# Altium schematic sheet monitoring.SchDoc
size Tabloid
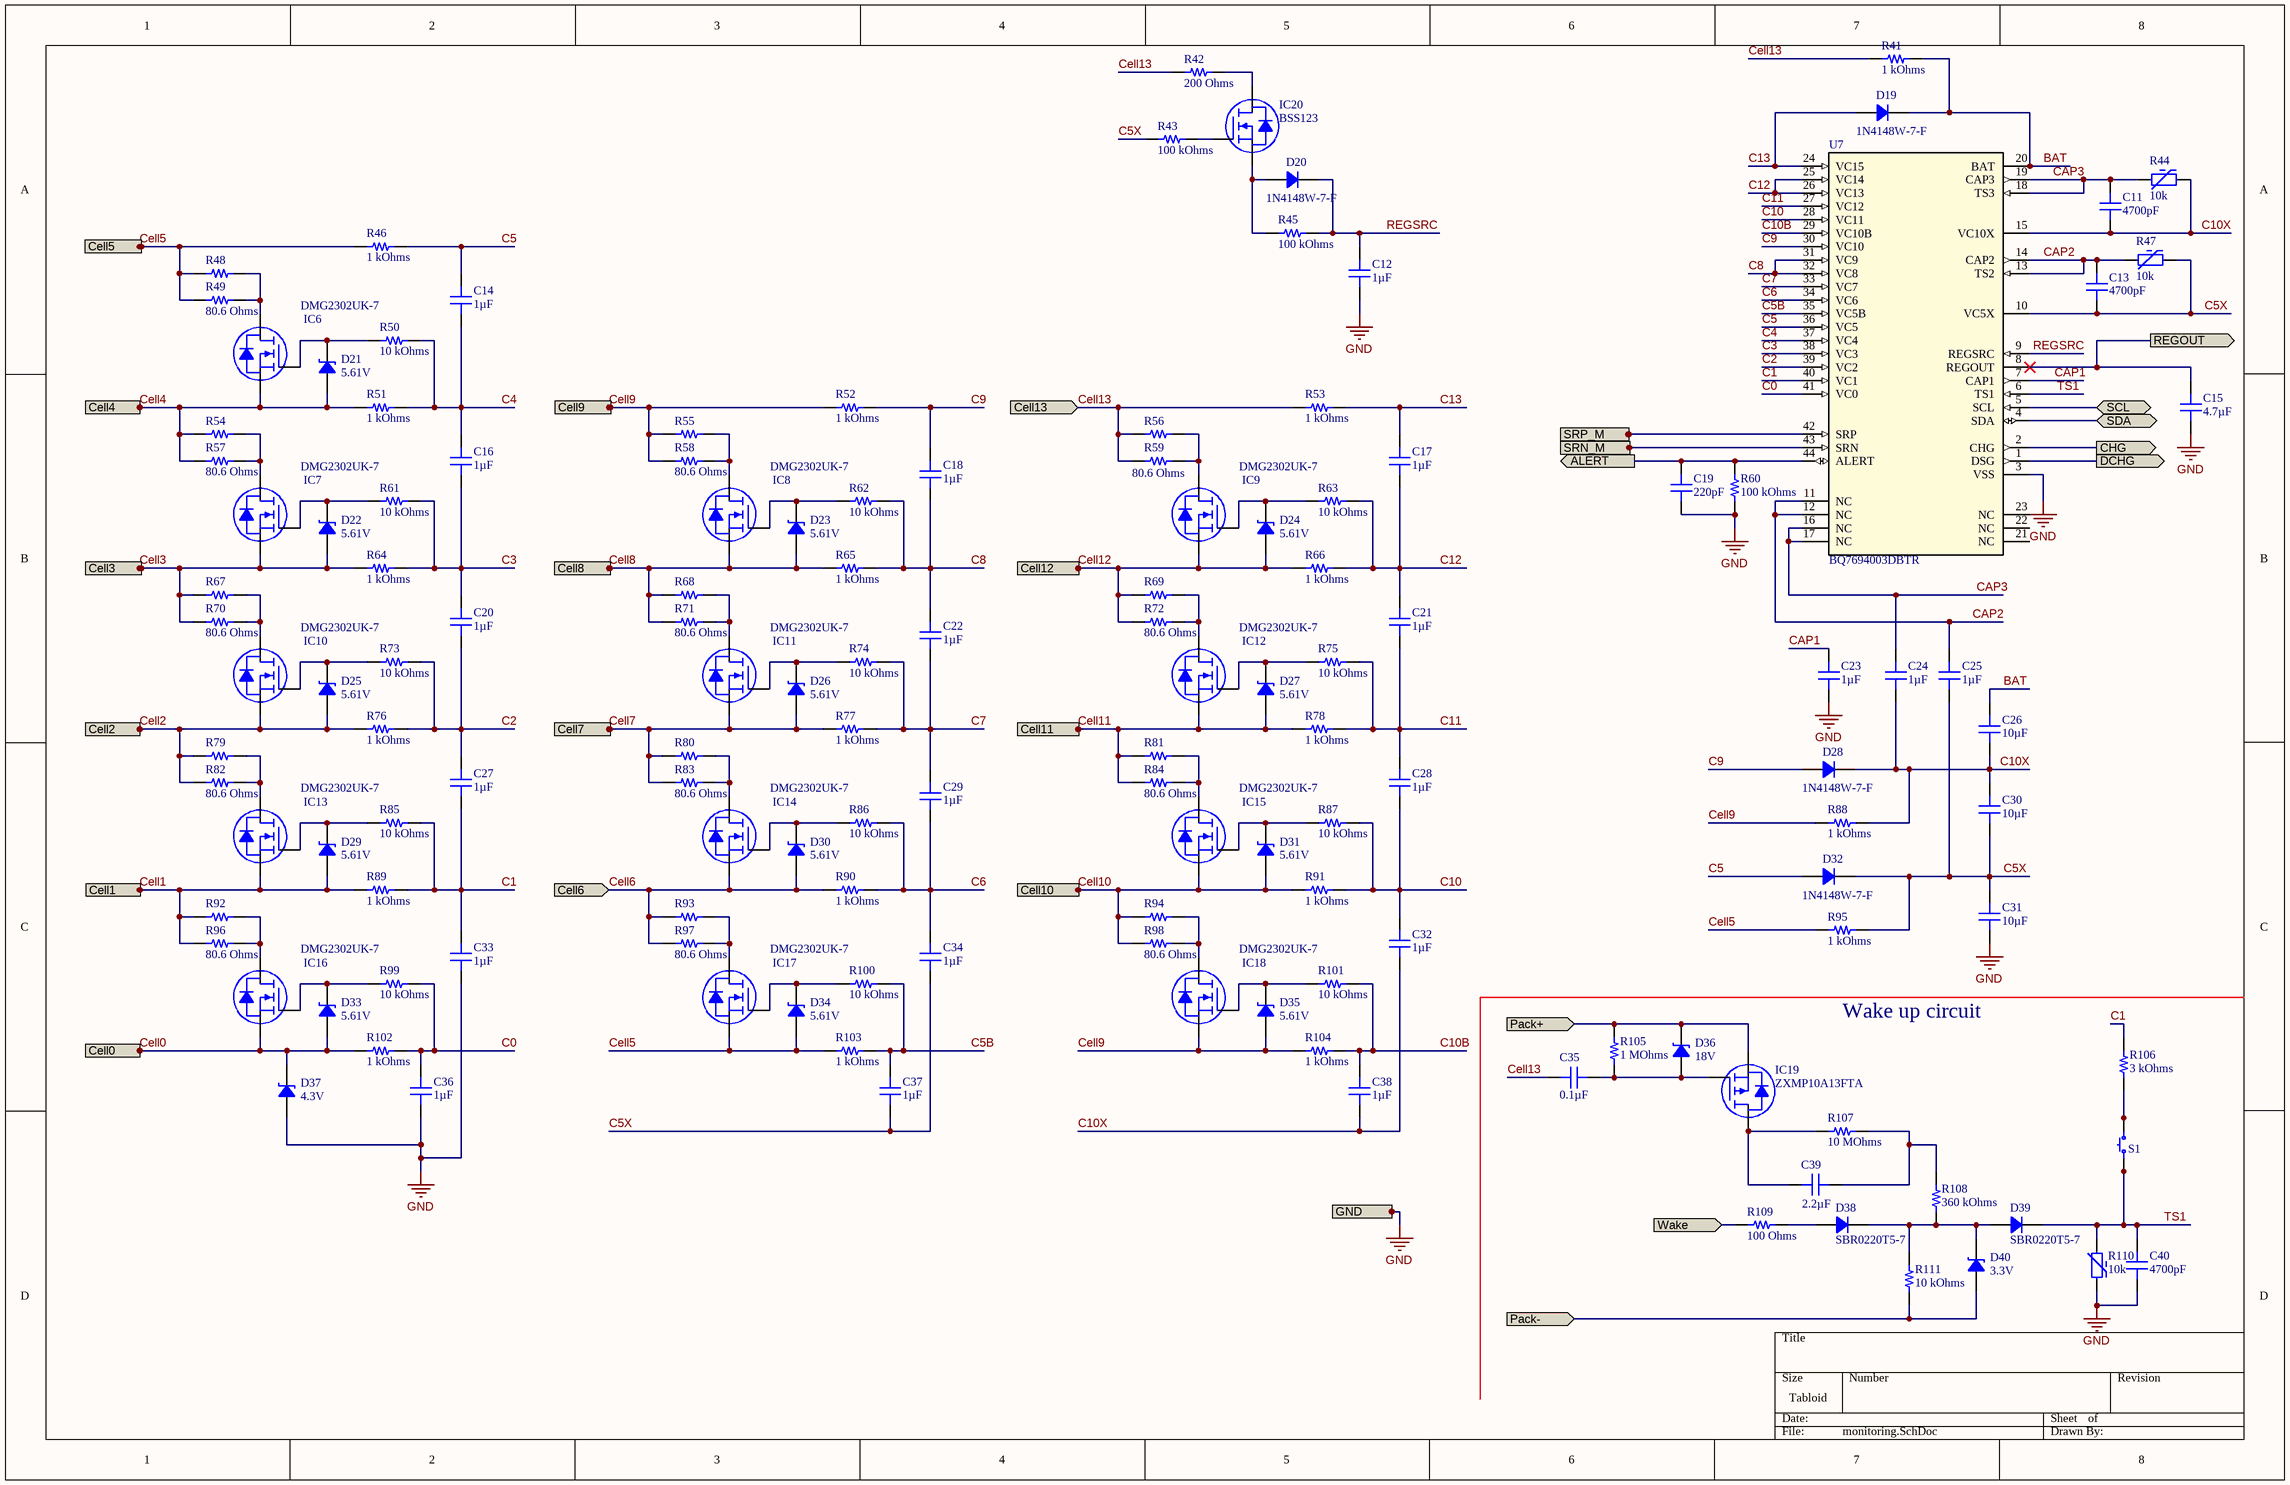
[diagram p0: monitoring.SchDoc]

## Parts
C11  4700pF  [CAP 0805_2012]
C12  1µF  [CAP 0603_1608]
C13  4700pF  [CAP 0805_2012]
C14  1µF  [CAP 0603_1608]
C15  4.7µF  [CAP 0805_2012]
C16  1µF  [CAP 0603_1608]
C17  1µF  [CAP 0603_1608]
C18  1µF  [CAP 0603_1608]
C19  220pF  [CAP 0603_1608]
C20  1µF  [CAP 0603_1608]
C21  1µF  [CAP 0603_1608]
C22  1µF  [CAP 0603_1608]
C23  1µF  [CAP 0603_1608]
C24  1µF  [CAP 0603_1608]
C25  1µF  [CAP 0603_1608]
C26  10µF  [CAP 1210_3225 - 2.8MM]
C27  1µF  [CAP 0603_1608]
C28  1µF  [CAP 0603_1608]
C29  1µF  [CAP 0603_1608]
C30  10µF  [CAP 1210_3225 - 2.8MM]
C31  10µF  [CAP 1210_3225 - 2.8MM]
C32  1µF  [CAP 0603_1608]
C33  1µF  [CAP 0603_1608]
C34  1µF  [CAP 0603_1608]
C35  0.1µF  [CAP 0603_1608]
C36  1µF  [CAP 0603_1608]
C37  1µF  [CAP 0603_1608]
C38  1µF  [CAP 0603_1608]
C39  2.2µF  [CAP 1210_3225 - 2.5MM]
C40  4700pF  [CAP 0805_2012]
D19  1N4148W-7-F  [SOD-123]
D20  1N4148W-7-F  [SOD-123]
D21  Voltage - Zener (Nom) (Vz): 5.61V  [SOD523F]  (hidden comment: MM5Z5V6ST1G)
D22  Voltage - Zener (Nom) (Vz): 5.61V  [SOD523F]  (hidden comment: MM5Z5V6ST1G)
D23  Voltage - Zener (Nom) (Vz): 5.61V  [SOD523F]  (hidden comment: MM5Z5V6ST1G)
D24  Voltage - Zener (Nom) (Vz): 5.61V  [SOD523F]  (hidden comment: MM5Z5V6ST1G)
D25  Voltage - Zener (Nom) (Vz): 5.61V  [SOD523F]  (hidden comment: MM5Z5V6ST1G)
D26  Voltage - Zener (Nom) (Vz): 5.61V  [SOD523F]  (hidden comment: MM5Z5V6ST1G)
D27  Voltage - Zener (Nom) (Vz): 5.61V  [SOD523F]  (hidden comment: MM5Z5V6ST1G)
D28  1N4148W-7-F  [SOD-123]
D29  Voltage - Zener (Nom) (Vz): 5.61V  [SOD523F]  (hidden comment: MM5Z5V6ST1G)
D30  Voltage - Zener (Nom) (Vz): 5.61V  [SOD523F]  (hidden comment: MM5Z5V6ST1G)
D31  Voltage - Zener (Nom) (Vz): 5.61V  [SOD523F]  (hidden comment: MM5Z5V6ST1G)
D32  1N4148W-7-F  [SOD-123]
D33  Voltage - Zener (Nom) (Vz): 5.61V  [SOD523F]  (hidden comment: MM5Z5V6ST1G)
D34  Voltage - Zener (Nom) (Vz): 5.61V  [SOD523F]  (hidden comment: MM5Z5V6ST1G)
D35  Voltage - Zener (Nom) (Vz): 5.61V  [SOD523F]  (hidden comment: MM5Z5V6ST1G)
D36  Voltage - Zener (Nom) (Vz): 18V  [DIODES SOT-523]  (hidden comment: MMBZ5248BT-7-F)
D37  Voltage - Zener (Nom) (Vz): 4.3V  [SOD-123]  (hidden comment: MMSZ5229BT1G)
D38  SBR0220T5-7  [SOD-523]
D39  SBR0220T5-7  [SOD-523]
D40  Voltage - Zener (Nom) (Vz): 3.3V  [DIODES SOT-323-3]  (hidden comment: MMBZ5226BW-7-F)
IC6  DMG2302UK-7  [DIODES SOT-23-3]
IC7  DMG2302UK-7  [DIODES SOT-23-3]
IC8  DMG2302UK-7  [DIODES SOT-23-3]
IC9  DMG2302UK-7  [DIODES SOT-23-3]
IC10  DMG2302UK-7  [DIODES SOT-23-3]
IC11  DMG2302UK-7  [DIODES SOT-23-3]
IC12  DMG2302UK-7  [DIODES SOT-23-3]
IC13  DMG2302UK-7  [DIODES SOT-23-3]
IC14  DMG2302UK-7  [DIODES SOT-23-3]
IC15  DMG2302UK-7  [DIODES SOT-23-3]
IC16  DMG2302UK-7  [DIODES SOT-23-3]
IC17  DMG2302UK-7  [DIODES SOT-23-3]
IC18  DMG2302UK-7  [DIODES SOT-23-3]
IC19  ZXMP10A13FTA  [DIODES SOT-23-3]
IC20  BSS123  [ON SEMI SOT-23-3]
R41  1 kOhms  [RES 0603_1608]
R42  200 Ohms  [RES 0603_1608]
R43  100 kOhms  [RES 0603_1608]
R44  10k  [NTC 0603_1608]
R45  100 kOhms  [RES 0603_1608]
R46  1 kOhms  [RES 0603_1608]
R47  10k  [NTC 0603_1608]
R48  80.6 Ohms  [RES 1206_3216]  (value not drawn)
R49  80.6 Ohms  [RES 1206_3216]
R50  10 kOhms  [RES 0603_1608]
R51  1 kOhms  [RES 0603_1608]
R52  1 kOhms  [RES 0603_1608]
R53  1 kOhms  [RES 0603_1608]
R54  80.6 Ohms  [RES 1206_3216]  (value not drawn)
R55  80.6 Ohms  [RES 1206_3216]  (value not drawn)
R56  80.6 Ohms  [RES 1206_3216]  (value not drawn)
R57  80.6 Ohms  [RES 1206_3216]
R58  80.6 Ohms  [RES 1206_3216]
R59  80.6 Ohms  [RES 1206_3216]
R60  100 kOhms  [RES 0603_1608]
R61  10 kOhms  [RES 0603_1608]
R62  10 kOhms  [RES 0603_1608]
R63  10 kOhms  [RES 0603_1608]
R64  1 kOhms  [RES 0603_1608]
R65  1 kOhms  [RES 0603_1608]
R66  1 kOhms  [RES 0603_1608]
R67  80.6 Ohms  [RES 1206_3216]  (value not drawn)
R68  80.6 Ohms  [RES 1206_3216]  (value not drawn)
R69  80.6 Ohms  [RES 1206_3216]  (value not drawn)
R70  80.6 Ohms  [RES 1206_3216]
R71  80.6 Ohms  [RES 1206_3216]
R72  80.6 Ohms  [RES 1206_3216]
R73  10 kOhms  [RES 0603_1608]
R74  10 kOhms  [RES 0603_1608]
R75  10 kOhms  [RES 0603_1608]
R76  1 kOhms  [RES 0603_1608]
R77  1 kOhms  [RES 0603_1608]
R78  1 kOhms  [RES 0603_1608]
R79  80.6 Ohms  [RES 1206_3216]  (value not drawn)
R80  80.6 Ohms  [RES 1206_3216]  (value not drawn)
R81  80.6 Ohms  [RES 1206_3216]  (value not drawn)
R82  80.6 Ohms  [RES 1206_3216]
R83  80.6 Ohms  [RES 1206_3216]
R84  80.6 Ohms  [RES 1206_3216]
R85  10 kOhms  [RES 0603_1608]
R86  10 kOhms  [RES 0603_1608]
R87  10 kOhms  [RES 0603_1608]
R88  1 kOhms  [RES 0603_1608]
R89  1 kOhms  [RES 0603_1608]
R90  1 kOhms  [RES 0603_1608]
R91  1 kOhms  [RES 0603_1608]
R92  80.6 Ohms  [RES 1206_3216]  (value not drawn)
R93  80.6 Ohms  [RES 1206_3216]  (value not drawn)
R94  80.6 Ohms  [RES 1206_3216]  (value not drawn)
R95  1 kOhms  [RES 0603_1608]
R96  80.6 Ohms  [RES 1206_3216]
R97  80.6 Ohms  [RES 1206_3216]
R98  80.6 Ohms  [RES 1206_3216]
R99  10 kOhms  [RES 0603_1608]
R100  10 kOhms  [RES 0603_1608]
R101  10 kOhms  [RES 0603_1608]
R102  1 kOhms  [RES 0603_1608]
R103  1 kOhms  [RES 0603_1608]
R104  1 kOhms  [RES 0603_1608]
R105  1 MOhms  [RES 0603_1608]
R106  3 kOhms  [RES 0603_1608]
R107  10 MOhms  [RES 0603_1608]
R108  360 kOhms  [RES 0603_1608]
R109  100 Ohms  [RES 0603_1608]
R110  10k  [NTC 0603_1608]
R111  10 kOhms  [RES 0603_1608]
S1  PTS645SM43SMTR92 LFS  [C&K PTS645]  (value not drawn)
U7  BQ7694003DBTR  [TSSOP_44]

## Ports
ALERT (out), Cell0 (in), Cell1 (in), Cell2 (in), Cell3 (in), Cell4 (in), Cell5 (in), Cell6 (in), Cell7 (in), Cell8 (in), Cell9 (in), Cell10 (in), Cell11 (in), Cell12 (in), Cell13 (in), CHG (out), DCHG (out), GND, Pack+ (in), Pack- (in), REGOUT (out), SCL (bidir), SDA (bidir), SRN_M (in), SRP_M (in), Wake (in)

## Nets
GND: C12.1 C15.1 C19.1 C23.1 C31.1 C33.1 C36.1 C40.1 D37.1 R60.1 R110.1 U7.3(VSS) ; port GND
ALERT: C19.2 R60.2 U7.44(ALERT) ; port ALERT
BAT: C26.2 D19.2 R41.2 U7.20(BAT)
C0: C36.2 R99.1 R102.2 U7.41(VC0)
C1: C27.1 C33.2 R85.1 R89.2 R106.2 U7.40(VC1)
C2: C20.1 C27.2 R73.1 R76.2 U7.39(VC2)
C3: C16.1 C20.2 R61.1 R64.2 U7.38(VC3)
C4: C14.1 C16.2 R50.1 R51.2 U7.37(VC4)
C5: C14.2 D32.1 R46.2 U7.36(VC5)
C5B: C37.2 R100.1 R103.2 U7.35(VC5B)
C5X: C13.1 C25.1 C30.1 C31.2 C34.1 C37.1 D32.2 R43.2 R47.1 R95.2 U7.10(VC5X)
C6: C29.1 C34.2 R86.1 R90.2 U7.34(VC6)
C7: C22.1 C29.2 R74.1 R77.2 U7.33(VC7)
C8: C18.1 C22.2 R62.1 R65.2 U7.31(VC9) U7.32(VC8)
C9: C18.2 D28.1 R52.2 U7.30(VC10)
C10: C28.1 C32.2 R87.1 R91.2 U7.28(VC11)
C10B: C38.2 R101.1 R104.2 U7.29(VC10B)
C10X: C11.1 C24.1 C26.1 C30.2 C32.1 C38.1 D28.2 R44.1 R88.2 U7.15(VC10X)
C11: C21.1 C28.2 R75.1 R78.2 U7.27(VC12)
C12: C17.1 C21.2 R63.1 R66.2 U7.25(VC14) U7.26(VC13)
C13: C17.2 D19.1 R53.2 U7.24(VC15)
CAP1: C23.2 U7.7(CAP1)
CAP2: C13.2 C25.2 R47.2 U7.11(NC) U7.12(NC) U7.13(TS2) U7.14(CAP2)
CAP3: C11.2 C24.2 R44.2 U7.16(NC) U7.17(NC) U7.18(TS3) U7.19(CAP3)
Cell0: D33.1 D37.2 IC16.2(S) R102.1 ; port Cell0
Cell1: D29.1 IC13.2(S) R89.1 R92.1 R96.1 ; port Cell1
Cell2: D25.1 IC10.2(S) R76.1 R79.1 R82.1 ; port Cell2
Cell3: D22.1 IC7.2(S) R64.1 R67.1 R70.1 ; port Cell3
Cell4: D21.1 IC6.2(S) R51.1 R54.1 R57.1 ; port Cell4
Cell5: D34.1 IC17.2(S) R46.1 R48.1 R49.1 R95.1 R103.1 ; port Cell5
Cell6: D30.1 IC14.2(S) R90.1 R93.1 R97.1 ; port Cell6
Cell7: D26.1 IC11.2(S) R77.1 R80.1 R83.1 ; port Cell7
Cell8: D23.1 IC8.2(S) R65.1 R68.1 R71.1 ; port Cell8
Cell9: D35.1 IC18.2(S) R52.1 R55.1 R58.1 R88.1 R104.1 ; port Cell9
Cell10: D31.1 IC15.2(S) R91.1 R94.1 R98.1 ; port Cell10
Cell11: D27.1 IC12.2(S) R78.1 R81.1 R84.1 ; port Cell11
Cell12: D24.1 IC9.2(S) R66.1 R69.1 R72.1 ; port Cell12
Cell13: C35.2 R41.1 R42.1 R53.1 R56.1 R59.1 ; port Cell13
CHG: U7.2(CHG) ; port CHG
DCHG: U7.1(DSG) ; port DCHG
Pack+: D36.2 IC19.2(S) R105.1 ; port Pack+
Pack-: D40.1 R111.2 ; port Pack-
REGOUT: C15.2 U7.8(REGOUT) ; port REGOUT
REGSRC: C12.2 D20.2 R45.1 U7.9(REGSRC)
SCL: U7.5(SCL) ; port SCL
SDA: U7.4(SDA) ; port SDA
SRN_M: U7.43(SRN) ; port SRN_M
SRP_M: U7.42(SRP) ; port SRP_M
TS1: C40.2 D39.2 R110.2 S1.1 S1.2 U7.6(TS1)
Wake: R109.2 ; port Wake
NetC35_1: C35.1 D36.1 IC19.1(G) R105.2
NetC39_1: C39.1 IC19.3(D) R107.2
NetC39_2: C39.2 R107.1 R108.2
NetD20_1: D20.1 IC20.2(S) R45.2
NetD21_2: D21.2 IC6.1(G) R50.2
NetD22_2: D22.2 IC7.1(G) R61.2
NetD23_2: D23.2 IC8.1(G) R62.2
NetD24_2: D24.2 IC9.1(G) R63.2
NetD25_2: D25.2 IC10.1(G) R73.2
NetD26_2: D26.2 IC11.1(G) R74.2
NetD27_2: D27.2 IC12.1(G) R75.2
NetD29_2: D29.2 IC13.1(G) R85.2
NetD30_2: D30.2 IC14.1(G) R86.2
NetD31_2: D31.2 IC15.1(G) R87.2
NetD33_2: D33.2 IC16.1(G) R99.2
NetD34_2: D34.2 IC17.1(G) R100.2
NetD35_2: D35.2 IC18.1(G) R101.2
NetD38_1: D38.1 R109.1
NetD38_2: D38.2 D39.1 D40.2 R108.1 R111.1
NetIC6_3: IC6.3(D) R48.2 R49.2
NetIC7_3: IC7.3(D) R54.2 R57.2
NetIC8_3: IC8.3(D) R55.2 R58.2
NetIC9_3: IC9.3(D) R56.2 R59.2
NetIC10_3: IC10.3(D) R67.2 R70.2
NetIC11_3: IC11.3(D) R68.2 R71.2
NetIC12_3: IC12.3(D) R69.2 R72.2
NetIC13_3: IC13.3(D) R79.2 R82.2
NetIC14_3: IC14.3(D) R80.2 R83.2
NetIC15_3: IC15.3(D) R81.2 R84.2
NetIC16_3: IC16.3(D) R92.2 R96.2
NetIC17_3: IC17.3(D) R93.2 R97.2
NetIC18_3: IC18.3(D) R94.2 R98.2
NetIC20_1: IC20.1(G) R43.1
NetIC20_3: IC20.3(D) R42.2
NetR106_1: R106.1 S1.3 S1.4

Not connected (* = marked no-connect by the designer): U7 21(NC) 22(NC) 23(NC)

## Notes on the sheet
- Wake up circuit

## Library data of the parts
C11 C13 C40 = VJ0805Y472KXAAC: CAP CER 4700PF 50V X7R 0805; Manufacturer: Vishay Vitramon; Tolerance: ±10%; Part Number: VJ0805Y472KXAAC; Value: 4700pF; Applications: General Purpose; Capacitance: 4700pF; ComponentLink1Description: Datasheet; ComponentLink1URL: http://www.vishay.com/docs/45199/vjcommercialseries.pdf; ComponentLink2Description: DigiKey Link; ComponentLink2URL: http://digikey.com/product-detail/en/vishay-vitramon/VJ0805Y472KXAAC/720-1393-1-ND/3986147; Device Package: 0805 (2012 Metric); LastUpdated: 9/2/2020 1:04:35 AM; Lifecycle Status: Active; Minimum Order: 1; Mounting Type: Surface Mount, MLCC; Operating Temperature: -55°C ~ 125°C; Package / Case: 0805 (2012 Metric); Packaging: TapeAndReel; PartId: 6525; Part Status: Active; Price: 0.06; Series: VJ; Size / Dimension: 0.079" L x 0.049" W (2.00mm x 1.25mm); Supplier 1: DigiKey; Supplier Part Number 1: 720-1393-1-ND; Temperature Coefficient: X7R; Thickness (Max): 0.057" (1.45mm); Voltage - Rated: 50V
C12 C14 C16-C18 C20-C25 C27-C29 C32-C34 C36-C38 = CGA3E3X5R1H105K080AB: CAP CER 1UF 50V X5R 0603; Manufacturer: TDK Corporation; Tolerance: ±10%; Part Number: CGA3E3X5R1H105K080AB; Value: 1µF; Applications: Automotive; Capacitance: 1µF; ComponentLink1Description: Datasheet; ComponentLink1URL: https://product.tdk.com/info/en/catalog/datasheets/mlcc_automotive_general_en.pdf?ref_disty=digikey; ComponentLink2Description: DigiKey Link; ComponentLink2URL: http://digikey.com/product-detail/en/tdk-corporation/CGA3E3X5R1H105K080AB/445-7878-1-ND/2781382; Device Package: 0603 (1608 Metric); LastUpdated: 9/2/2020 1:03:17 AM; Lifecycle Status: Active; Minimum Order: 1; Mounting Type: Surface Mount, MLCC; Operating Temperature: -55°C ~ 85°C; Package / Case: 0603 (1608 Metric); Packaging: TapeAndReel; PartId: 12841; Part Status: Active; Price: 0.05; Ratings: AEC-Q200; Series: CGA; Size / Dimension: 0.063" L x 0.031" W (1.60mm x 0.80mm); Supplier 1: DigiKey; Supplier Part Number 1: 445-7878-1-ND; Temperature Coefficient: X5R; Thickness (Max): 0.035" (0.90mm); Voltage - Rated: 50V
C15 = CC0805KKX7R7BB475: CAP CER 4.7UF 16V X7R 0805; Manufacturer: Yageo; Tolerance: ±10%; Part Number: CC0805KKX7R7BB475; Value: 4.7µF; Applications: General Purpose; Capacitance: 4.7µF; ComponentLink1Description: Datasheet; ComponentLink1URL: https://www.yageo.com/upload/media/product/productsearch/datasheet/mlcc/UPY-GPHC_X7R_6.3V-to-50V_18.pdf; ComponentLink2Description: DigiKey Link; ComponentLink2URL: http://digikey.com/product-detail/en/yageo/CC0805KKX7R7BB475/311-1883-1-ND/5195785; Device Package: 0805 (2012 Metric); LastUpdated: 9/2/2020 1:04:23 AM; Lifecycle Status: Active; Minimum Order: 1; Mounting Type: Surface Mount, MLCC; Operating Temperature: -55°C ~ 125°C; Package / Case: 0805 (2012 Metric); Packaging: TapeAndReel; PartId: 12987; Part Status: Active; Price: 0.09; Series: CC; Size / Dimension: 0.079" L x 0.049" W (2.00mm x 1.25mm); Supplier 1: DigiKey; Supplier Part Number 1: 311-1883-1-ND; Temperature Coefficient: X7R; Thickness (Max): 0.057" (1.45mm); Voltage - Rated: 16V
C19 = CC0603KRX7R9BB221: CAP CER 220PF 50V X7R 0603; Manufacturer: Yageo; Tolerance: ±10%; Part Number: CC0603KRX7R9BB221; Value: 220pF; Applications: General Purpose; Capacitance: 220pF; ComponentLink1Description: Datasheet; ComponentLink1URL: https://www.yageo.com/upload/media/product/productsearch/datasheet/mlcc/UPY-GPHC_X7R_6.3V-to-50V_18.pdf; ComponentLink2Description: DigiKey Link; ComponentLink2URL: http://digikey.com/product-detail/en/yageo/CC0603KRX7R9BB221/311-1077-1-ND/302987; Device Package: 0603 (1608 Metric); LastUpdated: 9/2/2020 1:03:05 AM; Lifecycle Status: Active; Minimum Order: 1; Mounting Type: Surface Mount, MLCC; Operating Temperature: -55°C ~ 125°C; Package / Case: 0603 (1608 Metric); Packaging: TapeAndReel; PartId: 16734; Part Status: Active; Price: 0.01; Series: CC; Size / Dimension: 0.063" L x 0.031" W (1.60mm x 0.80mm); Supplier 1: DigiKey; Supplier Part Number 1: 311-1077-1-ND; Temperature Coefficient: X7R; Thickness (Max): 0.035" (0.90mm); Voltage - Rated: 50V
C26 C30 C31 = C3225X5R1H106K250AB: CAP CER 10UF 50V X5R 1210; Manufacturer: TDK Corporation; Tolerance: ±10%; Part Number: C3225X5R1H106K250AB; Value: 10µF; Applications: General Purpose; Capacitance: 10µF; ComponentLink1Description: Datasheet; ComponentLink1URL: https://product.tdk.com/info/en/catalog/datasheets/mlcc_commercial_general_en.pdf?ref_disty=digikey; ComponentLink2Description: DigiKey Link; ComponentLink2URL: http://digikey.com/product-detail/en/tdk-corporation/C3225X5R1H106K250AB/445-9074-1-ND/3648647; Device Package: 1210 (3225 Metric); Features: Low ESL; LastUpdated: 9/2/2020 1:10:51 AM; Lifecycle Status: Active; Minimum Order: 1; Mounting Type: Surface Mount, MLCC; Operating Temperature: -55°C ~ 85°C; Package / Case: 1210 (3225 Metric); Packaging: TapeAndReel; PartId: 23834; Part Status: Active; Price: 0.34; Series: C; Size / Dimension: 0.126" L x 0.098" W (3.20mm x 2.50mm); Supplier 1: DigiKey; Supplier Part Number 1: 445-9074-1-ND; Temperature Coefficient: X5R; Thickness (Max): 0.110" (2.80mm); Voltage - Rated: 50V
C35 = GCJ188R72A104KA01D: CAP CER 0.1UF 100V X7R 0603; Manufacturer: Murata Electronics; Tolerance: ±10%; Part Number: GCJ188R72A104KA01D; Value: 0.1µF; Applications: Automotive, Boardflex Sensitive; Capacitance: 0.1µF; ComponentLink1Description: Datasheet; ComponentLink1URL: https://www.murata.com/~/media/webrenewal/support/library/catalog/products/capacitor/mlcc/c03e.ashx?la=en-us; ComponentLink2Description: DigiKey Link; ComponentLink2URL: http://digikey.com/product-detail/en/murata-electronics/GCJ188R72A104KA01D/490-13420-1-ND/6012292; Device Package: 0603 (1608 Metric); Features: Soft Termination; LastUpdated: 9/2/2020 1:03:01 AM; Lifecycle Status: Active; Minimum Order: 1; Mounting Type: Surface Mount, MLCC; Operating Temperature: -55°C ~ 125°C; Package / Case: 0603 (1608 Metric); Packaging: TapeAndReel; PartId: 17976; Part Status: Active; Price: 0.05; Ratings: AEC-Q200; Series: GCJ; Size / Dimension: 0.063" L x 0.031" W (1.60mm x 0.80mm); Supplier 1: DigiKey; Supplier Part Number 1: 490-13420-1-ND; Temperature Coefficient: X7R; Thickness (Max): 0.035" (0.90mm); Voltage - Rated: 100V
C39 = C3225X7R2A225K230AE: CAP CER 2.2UF 100V X7R 1210; Manufacturer: TDK Corporation; Tolerance: ±10%; Part Number: C3225X7R2A225K230AE; Value: 2.2µF; Applications: Boardflex Sensitive; Capacitance: 2.2µF; ComponentLink1Description: Datasheet; ComponentLink1URL: https://product.tdk.com/info/en/catalog/datasheets/mlcc_commercial_soft_en.pdf?ref_disty=digikey; ComponentLink2Description: DigiKey Link; ComponentLink2URL: http://digikey.com/product-detail/en/tdk-corporation/C3225X7R2A225K230AE/445-8913-1-ND/3283757; Device Package: 1210 (3225 Metric); Features: Soft Termination; LastUpdated: 9/2/2020 1:10:44 AM; Lifecycle Status: Active; Minimum Order: 1; Mounting Type: Surface Mount, MLCC; Operating Temperature: -55°C ~ 125°C; Package / Case: 1210 (3225 Metric); Packaging: TapeAndReel; PartId: 24320; Part Status: Active; Price: 0.39; Series: C; Size / Dimension: 0.126" L x 0.098" W (3.20mm x 2.50mm); Supplier 1: DigiKey; Supplier Part Number 1: 445-8913-1-ND; Temperature Coefficient: X7R; Thickness (Max): 0.098" (2.50mm); Voltage - Rated: 100V
D19 D20 D28 D32 = 1N4148W-7-F: DIODE GEN PURP 100V 300MA SOD123; Manufacturer: Diodes Incorporated; Current - Average Rectified (Io): 300mA (DC); Current - Reverse Leakage @ Vr: 1µA @ 75V; Diode Type: Standard; Reverse Recovery Time (trr): 4ns; Speed: Small Signal =< 200mA (Io), Any Speed; Voltage - Forward (Vf) (Max) @ If: 1.25V @ 150mA; Part Number: 1N4148W-7-F; ComponentLink1Description: Datasheet; ComponentLink1URL: https://www.diodes.com/assets/Datasheets/ds30086.pdf; ComponentLink2Description: DigiKey Link; ComponentLink2URL: http://digikey.com/product-detail/en/diodes-incorporated/1N4148W-7-F/1N4148W-FDICT-ND/815280; LastUpdated: 9/2/2020 1:19:08 AM; Lifecycle Status: Active; Minimum Order: 1; Mounting Type: Surface Mount; Operating Temperature - Junction: -65°C ~ 150°C; Package / Case: SOD-123; Packaging: TapeAndReel; PartId: 1002; Part Status: Active; Price: 0.03; Series: -; Supplier 1: DigiKey; Supplier Part Number 1: 1N4148W-FDICT-ND; Supplier Device Package: SOD-123; Voltage - DC Reverse (Vr) (Max): 100V
D21-D27 D29-D31 D33-D35 = MM5Z5V6ST1G: DIODE ZENER 5.61V 500MW SOD523; Manufacturer: ON Semiconductor; Current - Reverse Leakage @ Vr: 1µA @ 2V; Impedance (Max) (Zzt): 40 Ohms; Tolerance: ±2%; Voltage - Forward (Vf) (Max) @ If: 900mV @ 10mA; Part Number: MM5Z5V6ST1G; ComponentLink1Description: Datasheet; ComponentLink1URL: https://www.onsemi.com/pub/Collateral/MM5Z2V4ST1-D.PDF; ComponentLink2Description: DigiKey Link; ComponentLink2URL: http://digikey.com/product-detail/en/on-semiconductor/MM5Z5V6ST1G/MM5Z5V6ST1GOSCT-ND/964551; LastUpdated: 9/2/2020 1:19:35 AM; Lifecycle Status: Active; Minimum Order: 1; Mounting Type: Surface Mount; Operating Temperature: -65°C ~ 150°C; Package / Case: SC-79, SOD-523; Packaging: TapeAndReel; PartId: 3287; Part Status: Active; Power - Max: 500mW; Price: 0.05; Series: Automotive, AEC-Q101; Supplier 1: DigiKey; Supplier Part Number 1: MM5Z5V6ST1GOSCT-ND; Supplier Device Package: SOD-523
D36 = MMBZ5248BT-7-F: DIODE ZENER 18V 150MW SOT523; Manufacturer: Diodes Incorporated; Current - Reverse Leakage @ Vr: 100nA @ 14V; Impedance (Max) (Zzt): 21 Ohms; Tolerance: ±5%; Voltage - Forward (Vf) (Max) @ If: 900mV @ 10mA; Part Number: MMBZ5248BT-7-F; ComponentLink1Description: Datasheet; ComponentLink1URL: https://www.diodes.com/assets/Datasheets/ds30267.pdf; ComponentLink2Description: DigiKey Link; ComponentLink2URL: http://digikey.com/product-detail/en/diodes-incorporated/MMBZ5248BT-7-F/MMBZ5248BT-7-FDICT-ND/5218419; LastUpdated: 9/2/2020 1:21:31 AM; Lifecycle Status: Active; Minimum Order: 1; Mounting Type: Surface Mount; Operating Temperature: -65°C ~ 150°C; Package / Case: SOT-523; Packaging: CutTape; PartId: 789; Part Status: Active; Power - Max: 150mW; Price: 0.39; Series: -; Supplier 1: DigiKey; Supplier Part Number 1: MMBZ5248BT-7-FDICT-ND; Supplier Device Package: SOT-523
D37 = MMSZ5229BT1G: DIODE ZENER 4.3V 500MW SOD123; Manufacturer: ON Semiconductor; Current - Reverse Leakage @ Vr: 5µA @ 1V; Impedance (Max) (Zzt): 22 Ohms; Tolerance: ±5%; Voltage - Forward (Vf) (Max) @ If: 900mV @ 10mA; Part Number: MMSZ5229BT1G; ComponentLink1Description: Datasheet; ComponentLink1URL: http://www.onsemi.com/pub/Collateral/MMSZ5221BT1-D.PDF; ComponentLink2Description: DigiKey Link; ComponentLink2URL: http://digikey.com/product-detail/en/on-semiconductor/MMSZ5229BT1G/MMSZ5229BT1GOSCT-ND/1139889; LastUpdated: 9/2/2020 1:19:25 AM; Lifecycle Status: Active; Minimum Order: 1; Mounting Type: Surface Mount; Operating Temperature: -55°C ~ 150°C; Package / Case: SOD-123; Packaging: TapeAndReel; PartId: 2271; Part Status: Active; Power - Max: 500mW; Price: 0.04; Series: -; Supplier 1: DigiKey; Supplier Part Number 1: MMSZ5229BT1GOSCT-ND; Supplier Device Package: SOD-123
D38 D39 = SBR0220T5-7: DIODE SBR 20V 200MA SOD523; Manufacturer: Diodes Incorporated; Current - Reverse Leakage @ Vr: 40µA @ 20V; Diode Type: Super Barrier; Speed: Small Signal =< 200mA (Io), Any Speed; Voltage - Forward (Vf) (Max) @ If: 470mV @ 200mA; Part Number: SBR0220T5-7; ComponentLink1Description: Datasheet; ComponentLink1URL: https://www.diodes.com/assets/Datasheets/SBR0220T5.pdf; ComponentLink2Description: DigiKey Link; ComponentLink2URL: http://digikey.com/product-detail/en/diodes-incorporated/SBR0220T5-7/SBR0220T5-7DICT-ND/2181113; Current - Average Rectified (Io): 200mA; LastUpdated: 9/2/2020 1:23:20 AM; Lifecycle Status: Active; Minimum Order: 1; Mounting Type: Surface Mount; Operating Temperature - Junction: -65°C ~ 150°C; Package / Case: SC-79, SOD-523; Packaging: TapeAndReel; PartId: 2765; Part Status: Active; Price: 0.09; Series: SBR®; Supplier 1: DigiKey; Supplier Part Number 1: SBR0220T5-7DICT-ND; Supplier Device Package: SOD-523; Voltage - DC Reverse (Vr) (Max): 20V
D40 = MMBZ5226BW-7-F: DIODE ZENER 3.3V 200MW SOT323; Manufacturer: Diodes Incorporated; Current - Reverse Leakage @ Vr: 25µA @ 1V; Impedance (Max) (Zzt): 28 Ohms; Tolerance: ±5%; Voltage - Forward (Vf) (Max) @ If: 900mV @ 10mA; Part Number: MMBZ5226BW-7-F; ComponentLink1Description: Datasheet; ComponentLink1URL: https://www.diodes.com/assets/Datasheets/ds31037.pdf; ComponentLink2Description: DigiKey Link; ComponentLink2URL: http://digikey.com/product-detail/en/diodes-incorporated/MMBZ5226BW-7-F/MMBZ5226BW-FDICT-ND/815754; LastUpdated: 9/2/2020 1:21:30 AM; Lifecycle Status: Active; Minimum Order: 1; Mounting Type: Surface Mount; Operating Temperature: -65°C ~ 150°C; Package / Case: SC-70, SOT-323; Packaging: CutTape; PartId: 834; Part Status: Active; Power - Max: 200mW; Price: 0.34; Series: -; Supplier 1: DigiKey; Supplier Part Number 1: MMBZ5226BW-FDICT-ND; Supplier Device Package: SOT-323
IC6-IC18 = DMG2302UK-7: MOSFET N-CH 20V 2.8A SOT23; Manufacturer: Diodes Incorporated; Current - Continuous Drain (Id) @ 25°C: 2.8A (Ta); Drive Voltage (Max Rds On,  Min Rds On): 2.5V, 4.5V; FET Type: N-Channel; Gate Charge (Qg) (Max) @ Vgs: 2.8nC @ 10V; Input Capacitance (Ciss) (Max) @ Vds: 130pF @ 10V; Power Dissipation (Max): 660mW (Ta); Rds On (Max) @ Id, Vgs: 90mOhm @ 3.6A, 4.5V; Vgs (Max): ±12V; Vgs(th) (Max) @ Id: 1V @ 250µA; Part Number: DMG2302UK-7; ComponentLink1Description: Datasheet; ComponentLink1URL: https://www.diodes.com/assets/Datasheets/DMG2302UK.pdf; ComponentLink2Description: DigiKey Link; ComponentLink2URL: http://digikey.com/product-detail/en/diodes-incorporated/DMG2302UK-7/DMG2302UK-7DICT-ND/6010163; Drain to Source Voltage (Vdss): 20V; LastUpdated: 9/2/2020 1:25:02 AM; Lifecycle Status: Active; Minimum Order: 1; Mounting Type: Surface Mount; Operating Temperature: -55°C ~ 150°C (TJ); Package / Case: TO-236-3, SC-59, SOT-23-3; Packaging: TapeAndReel; Part Status: Active; Price: 0.06; Series: Automotive, AEC-Q101; Supplier 1: DigiKey; Supplier Part Number 1: DMG2302UK-7DICT-ND; Supplier Device Package: SOT-23; Technology: MOSFET (Metal Oxide)
IC19 = ZXMP10A13FTA: MOSFET P-CH 100V 0.6A SOT23-3; Manufacturer: Diodes Incorporated; Current - Continuous Drain (Id) @ 25°C: 600mA (Ta); Drive Voltage (Max Rds On,  Min Rds On): 6V, 10V; FET Type: P-Channel; Gate Charge (Qg) (Max) @ Vgs: 3.5nC @ 10V; Input Capacitance (Ciss) (Max) @ Vds: 141pF @ 50V; Power Dissipation (Max): 625mW (Ta); Rds On (Max) @ Id, Vgs: 1Ohm @ 600mA, 10V; Vgs (Max): ±20V; Vgs(th) (Max) @ Id: 4V @ 250µA; Part Number: ZXMP10A13FTA; ComponentLink1Description: Datasheet; ComponentLink1URL: https://www.diodes.com/assets/Datasheets/ZXMP10A13F.pdf; ComponentLink2Description: DigiKey Link; ComponentLink2URL: http://digikey.com/product-detail/en/diodes-incorporated/ZXMP10A13FTA/ZXMP10A13FCT-ND/560670; Drain to Source Voltage (Vdss): 100V; LastUpdated: 9/2/2020 1:25:04 AM; Lifecycle Status: Active; Minimum Order: 1; Mounting Type: Surface Mount; Operating Temperature: -55°C ~ 150°C (TJ); Package / Case: TO-236-3, SC-59, SOT-23-3; Packaging: TapeAndReel; Part Status: Active; Price: 0.20; Series: -; Supplier 1: DigiKey; Supplier Part Number 1: ZXMP10A13FCT-ND; Supplier Device Package: SOT-23-3; Technology: MOSFET (Metal Oxide)
IC20 = BSS123: MOSFET N-CH 100V 170MA SOT-23; Manufacturer: ON Semiconductor; Current - Continuous Drain (Id) @ 25°C: 170mA (Ta); Drive Voltage (Max Rds On,  Min Rds On): 4.5V, 10V; FET Type: N-Channel; Gate Charge (Qg) (Max) @ Vgs: 2.5nC @ 10V; Input Capacitance (Ciss) (Max) @ Vds: 73pF @ 25V; Power Dissipation (Max): 360mW (Ta); Rds On (Max) @ Id, Vgs: 6Ohm @ 170mA, 10V; Vgs (Max): ±20V; Vgs(th) (Max) @ Id: 2V @ 1mA; Part Number: BSS123; ComponentLink1Description: Datasheet; ComponentLink1URL: https://www.onsemi.com/pub/Collateral/BSS123-D.PDF; ComponentLink2Description: DigiKey Link; ComponentLink2URL: http://digikey.com/product-detail/en/on-semiconductor/BSS123/BSS123NCT-ND/244665; Drain to Source Voltage (Vdss): 100V; LastUpdated: 9/2/2020 1:25:08 AM; Lifecycle Status: Active; Minimum Order: 1; Mounting Type: Surface Mount; Operating Temperature: -55°C ~ 150°C (TJ); Package / Case: TO-236-3, SC-59, SOT-23-3; Packaging: TapeAndReel; Part Status: Active; Price: 0.06; Series: -; Supplier 1: DigiKey; Supplier Part Number 1: BSS123NCT-ND; Supplier Device Package: SOT-23-3; Technology: MOSFET (Metal Oxide)
R41 R46 R51-R53 R64-R66 R76-R78 R88-R91 R95 R102-R104 = CRCW06031K00FKEA: RES SMD 1K OHM 1% 1/10W 0603; Manufacturer: Vishay Dale; Power (Watts): 0.1W, 1/10W; Temperature Coefficient: ±100ppm/°C; Part Number: CRCW06031K00FKEA; Value: 1 kOhms; ComponentLink1Description: Datasheet; ComponentLink1URL: http://www.vishay.com/docs/20035/dcrcwe3.pdf; ComponentLink2Description: DigiKey Link; ComponentLink2URL: http://digikey.com/product-detail/en/vishay-dale/CRCW06031K00FKEA/541-1.00KHCT-ND/1179809; Composition: Thick Film; Device Package: 0603 (1608 Metric); Features: Automotive AEC-Q200; Height - Seated (Max): 0.020" (0.50mm); LastUpdated: 9/2/2020 1:09:36 AM; Lifecycle Status: Active; Minimum Order: 1; Number of Terminations: 2; Operating Temperature: -55°C ~ 155°C; Package / Case: 0603 (1608 Metric); Packaging: CutTape; PartId: 24637; Part Status: Active; Price: 0.10; Ratings: AEC-Q200; Resistance: 1 kOhms; Series: CRCW; Size / Dimension: 0.061" L x 0.033" W (1.55mm x 0.85mm); Supplier 1: DigiKey; Supplier Part Number 1: 541-1.00KHCT-ND; Supplier Device Package: 0603; Tolerance: ±1%
R42 = CRCW0603200RFKEA: RES SMD 200 OHM 1% 1/10W 0603; Manufacturer: Vishay Dale; Power (Watts): 0.1W, 1/10W; Temperature Coefficient: ±100ppm/°C; Part Number: CRCW0603200RFKEA; Value: 200 Ohms; ComponentLink1Description: Datasheet; ComponentLink1URL: http://www.vishay.com/docs/20035/dcrcwe3.pdf; ComponentLink2Description: DigiKey Link; ComponentLink2URL: http://digikey.com/product-detail/en/vishay-dale/CRCW0603200RFKEA/541-200HCT-ND/1179727; Composition: Thick Film; Device Package: 0603 (1608 Metric); Features: Automotive AEC-Q200; Height - Seated (Max): 0.020" (0.50mm); LastUpdated: 9/2/2020 1:10:09 AM; Lifecycle Status: Active; Minimum Order: 1; Number of Terminations: 2; Operating Temperature: -55°C ~ 155°C; Package / Case: 0603 (1608 Metric); Packaging: CutTape; PartId: 12561; Part Status: Active; Price: 0.10; Ratings: AEC-Q200; Resistance: 200 Ohms; Series: CRCW; Size / Dimension: 0.061" L x 0.033" W (1.55mm x 0.85mm); Supplier 1: DigiKey; Supplier Part Number 1: 541-200HCT-ND; Supplier Device Package: 0603; Tolerance: ±1%
R43 R45 R60 = CRCW0603100KFKEA: RES SMD 100K OHM 1% 1/10W 0603; Manufacturer: Vishay Dale; Power (Watts): 0.1W, 1/10W; Temperature Coefficient: ±100ppm/°C; Part Number: CRCW0603100KFKEA; Value: 100 kOhms; ComponentLink1Description: Datasheet; ComponentLink1URL: http://www.vishay.com/docs/20035/dcrcwe3.pdf; ComponentLink2Description: DigiKey Link; ComponentLink2URL: http://digikey.com/product-detail/en/vishay-dale/CRCW0603100KFKEA/541-100KHCT-ND/1180038; Composition: Thick Film; Device Package: 0603 (1608 Metric); Features: Automotive AEC-Q200; Height - Seated (Max): 0.020" (0.50mm); LastUpdated: 9/2/2020 1:09:36 AM; Lifecycle Status: Active; Minimum Order: 1; Number of Terminations: 2; Operating Temperature: -55°C ~ 155°C; Package / Case: 0603 (1608 Metric); Packaging: CutTape; PartId: 24639; Part Status: Active; Price: 0.10; Ratings: AEC-Q200; Resistance: 100 kOhms; Series: CRCW; Size / Dimension: 0.061" L x 0.033" W (1.55mm x 0.85mm); Supplier 1: DigiKey; Supplier Part Number 1: 541-100KHCT-ND; Supplier Device Package: 0603; Tolerance: ±1%
R44 R47 R110 = NTCS0603E3103FMT: THERMISTOR NTC 10KOHM 3610K 0603; Manufacturer: Vishay BC Components; B Value Tolerance: ±1%; Power - Max: 125mW; Part Number: NTCS0603E3103FMT; B25/85: 3610K; ComponentLink1Description: Datasheet; ComponentLink1URL: http://www.vishay.com/docs/29056/ntcs0603e3t.pdf; ComponentLink2Description: DigiKey Link; ComponentLink2URL: http://digikey.com/product-detail/en/vishay-bc-components/NTCS0603E3103FMT/BC2472CT-ND/2230853; Device Package: 0603 (1608 Metric); LastUpdated: 9/2/2020 1:22:38 AM; Lifecycle Status: Active; Minimum Order: 1; Mounting Type: Surface Mount; Operating Temperature: -40°C ~ 150°C; Package / Case: 0603 (1608 Metric); Packaging: TapeAndReel; PartId: 450; Part Status: Active; Price: 0.38; Resistance in Ohms @ 25°C: 10k; Resistance Tolerance: ±1%; Series: Automotive, AEC-Q200; Supplier 1: DigiKey; Supplier Part Number 1: BC2472CT-ND; Value: 10k
R48 R49 R54-R59 R67-R72 R79-R84 R92-R94 R96-R98 = CRCW120680R6FKEA: RES SMD 80.6 OHM 1% 1/4W 1206; Manufacturer: Vishay Dale; Power (Watts): 0.25W, 1/4W; Temperature Coefficient: ±100ppm/°C; Part Number: CRCW120680R6FKEA; ComponentLink1Description: Datasheet; ComponentLink1URL: http://www.vishay.com/docs/20035/dcrcwe3.pdf; ComponentLink2Description: DigiKey Link; ComponentLink2URL: http://digikey.com/product-detail/en/vishay-dale/CRCW120680R6FKEA/541-80.6FCT-ND/1181635; Composition: Thick Film; Device Package: 1206 (3216 Metric); Features: Automotive AEC-Q200; Height - Seated (Max): 0.024" (0.60mm); LastUpdated: 9/2/2020 1:12:49 AM; Lifecycle Status: Active; Minimum Order: 1; Number of Terminations: 2; Operating Temperature: -55°C ~ 155°C; Package / Case: 1206 (3216 Metric); Packaging: TapeAndReel; PartId: 35493; Part Status: Active; Price: 0.01; Ratings: AEC-Q200; Resistance: 80.6 Ohms; Series: CRCW; Size / Dimension: 0.126" L x 0.063" W (3.20mm x 1.60mm); Supplier 1: DigiKey; Supplier Part Number 1: 541-80.6FCT-ND; Supplier Device Package: 1206; Tolerance: ±1%; Value: 80.6 Ohms
R50 R61-R63 R73-R75 R85-R87 R99-R101 R111 = CRCW060310K0FKEA: RES SMD 10K OHM 1% 1/10W 0603; Manufacturer: Vishay Dale; Power (Watts): 0.1W, 1/10W; Temperature Coefficient: ±100ppm/°C; Part Number: CRCW060310K0FKEA; Value: 10 kOhms; ComponentLink1Description: Datasheet; ComponentLink1URL: http://www.vishay.com/docs/20035/dcrcwe3.pdf; ComponentLink2Description: DigiKey Link; ComponentLink2URL: http://digikey.com/product-detail/en/vishay-dale/CRCW060310K0FKEA/541-10.0KHCT-ND/1179924; Composition: Thick Film; Device Package: 0603 (1608 Metric); Features: Automotive AEC-Q200; Height - Seated (Max): 0.020" (0.50mm); LastUpdated: 9/2/2020 1:09:36 AM; Lifecycle Status: Active; Minimum Order: 1; Number of Terminations: 2; Operating Temperature: -55°C ~ 155°C; Package / Case: 0603 (1608 Metric); Packaging: CutTape; PartId: 24636; Part Status: Active; Price: 0.10; Ratings: AEC-Q200; Resistance: 10 kOhms; Series: CRCW; Size / Dimension: 0.061" L x 0.033" W (1.55mm x 0.85mm); Supplier 1: DigiKey; Supplier Part Number 1: 541-10.0KHCT-ND; Supplier Device Package: 0603; Tolerance: ±1%
R105 = CRCW06031M00FKEA: RES SMD 1M OHM 1% 1/10W 0603; Manufacturer: Vishay Dale; Power (Watts): 0.1W, 1/10W; Temperature Coefficient: ±100ppm/°C; Part Number: CRCW06031M00FKEA; Value: 1 MOhms; ComponentLink1Description: Datasheet; ComponentLink1URL: http://www.vishay.com/docs/20035/dcrcwe3.pdf; ComponentLink2Description: DigiKey Link; ComponentLink2URL: http://digikey.com/product-detail/en/vishay-dale/CRCW06031M00FKEA/541-1.00MHCT-ND/1180152; Composition: Thick Film; Device Package: 0603 (1608 Metric); Features: Automotive AEC-Q200; Height - Seated (Max): 0.020" (0.50mm); LastUpdated: 9/2/2020 1:10:09 AM; Lifecycle Status: Active; Minimum Order: 1; Number of Terminations: 2; Operating Temperature: -55°C ~ 155°C; Package / Case: 0603 (1608 Metric); Packaging: CutTape; PartId: 12567; Part Status: Active; Price: 0.10; Ratings: AEC-Q200; Resistance: 1 MOhms; Series: CRCW; Size / Dimension: 0.061" L x 0.033" W (1.55mm x 0.85mm); Supplier 1: DigiKey; Supplier Part Number 1: 541-1.00MHCT-ND; Supplier Device Package: 0603; Tolerance: ±1%
R106 = CRCW06033K00FKEB: RES SMD 3K OHM 1% 1/10W 0603; Manufacturer: Vishay Dale; Power (Watts): 0.1W, 1/10W; Temperature Coefficient: ±100ppm/°C; Part Number: CRCW06033K00FKEB; Value: 3 kOhms; ComponentLink2Description: DigiKey Link; ComponentLink2URL: http://digikey.com/product-detail/en/vishay-dale/CRCW06033K00FKEB/541-CRCW06033K00FKEBCT-ND/11500725; Composition: Thick Film; Device Package: 0603 (1608 Metric); Features: Automotive AEC-Q200; LastUpdated: 9/2/2020 1:09:23 AM; Lifecycle Status: Active; Minimum Order: 1; Number of Terminations: 2; Operating Temperature: -55°C ~ 155°C; Package / Case: 0603 (1608 Metric); Packaging: Unknown; PartId: 56606; Price: 0.10; Ratings: AEC-Q200; Resistance: 3 kOhms; Series: CRCW; Supplier 1: DigiKey; Supplier Part Number 1: 541-CRCW06033K00FKEBCT-ND; Supplier Device Package: 0603; Tolerance: ±1%
R107 = CRCW060310M0FKEA: RES SMD 10M OHM 1% 1/10W 0603; Manufacturer: Vishay Dale; Power (Watts): 0.1W, 1/10W; Temperature Coefficient: ±100ppm/°C; Part Number: CRCW060310M0FKEA; Value: 10 MOhms; ComponentLink1Description: Datasheet; ComponentLink1URL: http://www.vishay.com/docs/20035/dcrcwe3.pdf; ComponentLink2Description: DigiKey Link; ComponentLink2URL: http://digikey.com/product-detail/en/vishay-dale/CRCW060310M0FKEA/541-10.0MHCT-ND/1180266; Composition: Thick Film; Device Package: 0603 (1608 Metric); Features: Automotive AEC-Q200; Height - Seated (Max): 0.020" (0.50mm); LastUpdated: 9/2/2020 1:10:08 AM; Lifecycle Status: Active; Minimum Order: 1; Number of Terminations: 2; Operating Temperature: -55°C ~ 155°C; Package / Case: 0603 (1608 Metric); Packaging: CutTape; PartId: 12816; Part Status: Active; Price: 0.10; Ratings: AEC-Q200; Resistance: 10 MOhms; Series: CRCW; Size / Dimension: 0.061" L x 0.033" W (1.55mm x 0.85mm); Supplier 1: DigiKey; Supplier Part Number 1: 541-10.0MHCT-ND; Supplier Device Package: 0603; Tolerance: ±1%
R108 = CRCW0603360KFKEA: RES SMD 360K OHM 1% 1/10W 0603; Manufacturer: Vishay Dale; Power (Watts): 0.1W, 1/10W; Temperature Coefficient: ±100ppm/°C; Part Number: CRCW0603360KFKEA; Value: 360 kOhms; ComponentLink1Description: Datasheet; ComponentLink1URL: http://www.vishay.com/docs/20035/dcrcwe3.pdf; ComponentLink2Description: DigiKey Link; ComponentLink2URL: http://digikey.com/product-detail/en/vishay-dale/CRCW0603360KFKEA/541-360KHCT-ND/1180100; Composition: Thick Film; Device Package: 0603 (1608 Metric); Features: Automotive AEC-Q200; Height - Seated (Max): 0.020" (0.50mm); LastUpdated: 9/2/2020 1:09:57 AM; Lifecycle Status: Active; Minimum Order: 1; Number of Terminations: 2; Operating Temperature: -55°C ~ 155°C; Package / Case: 0603 (1608 Metric); Packaging: CutTape; PartId: 17914; Part Status: Active; Price: 0.10; Ratings: AEC-Q200; Resistance: 360 kOhms; Series: CRCW; Size / Dimension: 0.061" L x 0.033" W (1.55mm x 0.85mm); Supplier 1: DigiKey; Supplier Part Number 1: 541-360KHCT-ND; Supplier Device Package: 0603; Tolerance: ±1%
R109 = CRCW0603100RFKTA: RES SMD 100 OHM 1% 1/10W 0603; Manufacturer: Vishay Dale; Power (Watts): 0.1W, 1/10W; Temperature Coefficient: ±100ppm/°C; Part Number: CRCW0603100RFKTA; Value: 100 Ohms; ComponentLink1Description: Datasheet; ComponentLink1URL: http://www.vishay.com/docs/20008/dcrcw.pdf; ComponentLink2Description: DigiKey Link; ComponentLink2URL: http://digikey.com/product-detail/en/vishay-dale/CRCW0603100RFKTA/541-2976-1-ND/6073619; Composition: Thick Film; Device Package: 0603 (1608 Metric); Features: Automotive AEC-Q200; Height - Seated (Max): 0.020" (0.50mm); LastUpdated: 9/2/2020 1:09:58 AM; Lifecycle Status: Active; Minimum Order: 1; Number of Terminations: 2; Operating Temperature: -55°C ~ 155°C; Package / Case: 0603 (1608 Metric); Packaging: TapeAndReel; PartId: 17521; Part Status: Active; Price: 0.01; Ratings: AEC-Q200; Resistance: 100 Ohms; Series: CRCW; Size / Dimension: 0.063" L x 0.033" W (1.60mm x 0.85mm); Supplier 1: DigiKey; Supplier Part Number 1: 541-2976-1-ND; Supplier Device Package: 0603; Tolerance: ±1%
S1 = PTS645SM43SMTR92 LFS: SWITCH TACTILE SPST-NO 0.05A 12V; Manufacturer: C&K; Actuator Height off PCB, Vertical: 4.30mm; Actuator Orientation: Top Actuated; Actuator Type: Standard; Contact Rating @ Voltage: 0.05A @ 12VDC; Illumination: Non-Illuminated; Operating Force: 160gf; Outline: 6.00mm x 6.00mm; Switch Function: Off-Mom; Part Number: PTS645SM43SMTR92 LFS; Circuit: SPST-NO; ComponentLink1Description: Datasheet; ComponentLink1URL: https://dznh3ojzb2azq.cloudfront.net/products/Tactile/PTS645/documents/datasheet.pdf; ComponentLink2Description: DigiKey Link; ComponentLink2URL: http://digikey.com/product-detail/en/c-k/PTS645SM43SMTR92-LFS/CKN9112CT-ND/1146934; Features: Blue Actuator; LastUpdated: 4/9/2020 9:59:00 AM; Lifecycle Status: Active; Minimum Order: 1; Mounting Type: Surface Mount; Operating Temperature: -20°C ~ 60°C; Packaging: TapeAndReel; Part Status: Active; Price: 0.09; Series: PTS645; Supplier 1: DigiKey; Supplier Part Number 1: CKN9112CT-ND; Termination Style: Gull Wing
U7 = BQ7694003DBTR: Battery Management Li-Ion, Li-Phosphate Battery Moniter; Vendor: Texas Instruments; Built_By: EMA_Jessica; SourceLibrary: TI_2019-03-25_2; Output Voltage: 16V; Operating Supply Voltage: 25V; Manufacturer_Part_Number: BQ7694003DBTR; Copyright: Copyright (C) 2018 Accelerated Designs. All rights reserved; RefDes: RefDes; Type: DEV; Supplier 1: Mouser; Manufacturer: Texas Instruments; Manufacturer Part Number: BQ7694003DBTR; Stock 1: 3729; Pricing 1: 1=5.18, 10=4.65, 25=4.39, 100=3.61, 250=3.24, 500=3.12 (USD); Mount: Surface Mount; Case/Package: TSSOP; Weight: 0.004914oz; Contact Plating: Gold; Min Operating Temperature: -40°C; Max Operating Temperature: 85°C; Packaging: Tape and Reel; Package Quantity: 2000; Lead Free: Lead Free; ComponentLink1URL: http://www.ti.com/lit/gpn/bq76940?src-supplier=Mouser; ComponentLink1Description: http://www.ti.com/lit/gpn/bq76940?src-supplier=Mouser; ComponentLink2URL: http://www.ti.com/general/docs/lit/getliterature.tsp?genericPartNumber=BQ76920&amp;&amp;fileType=pdf&src-supplier=Avnet+Asia; ComponentLink2Description: http://www.ti.com/general/docs/lit/getliterature.tsp?genericPartNumber=BQ76920&amp;&amp;fileType=pdf&src-supplier=Avnet+Asia; ComponentLink3URL: http://www.ti.com/general/docs/suppproductinfo.tsp?distId=10&amp;gotoUrl=http%3A%2F%2Fwww.ti.com%2Flit%2Fgpn%2Fbq76920&src-supplier=Digi-Key; ComponentLink3Description: http://www.ti.com/general/docs/suppproductinfo.tsp?distId=10&amp;gotoUrl=http%3A%2F%2Fwww.ti.com%2Flit%2Fgpn%2Fbq76920&src-supplier=Digi-Key; ComponentLink4URL: http://www.ti.com/general/docs/lit/getliterature.tsp?genericPartNumber=BQ76920&&fileType=pdf&src-supplier=Avnet; ComponentLink4Description: http://www.ti.com/general/docs/lit/getliterature.tsp?genericPartNumber=BQ76920&&fileType=pdf&src-supplier=Avnet; ComponentLink5URL: http://www.ti.com/lit/pdf/slpt046?src-supplier=Digi-Key; ComponentLink5Description: http://www.ti.com/lit/pdf/slpt046?src-supplier=Digi-Key; Supplier Part Number 1: 595-BQ7694003DBTR